# EAGLE design esp32 relay attempt 1 (EAGLE 9.6.2)
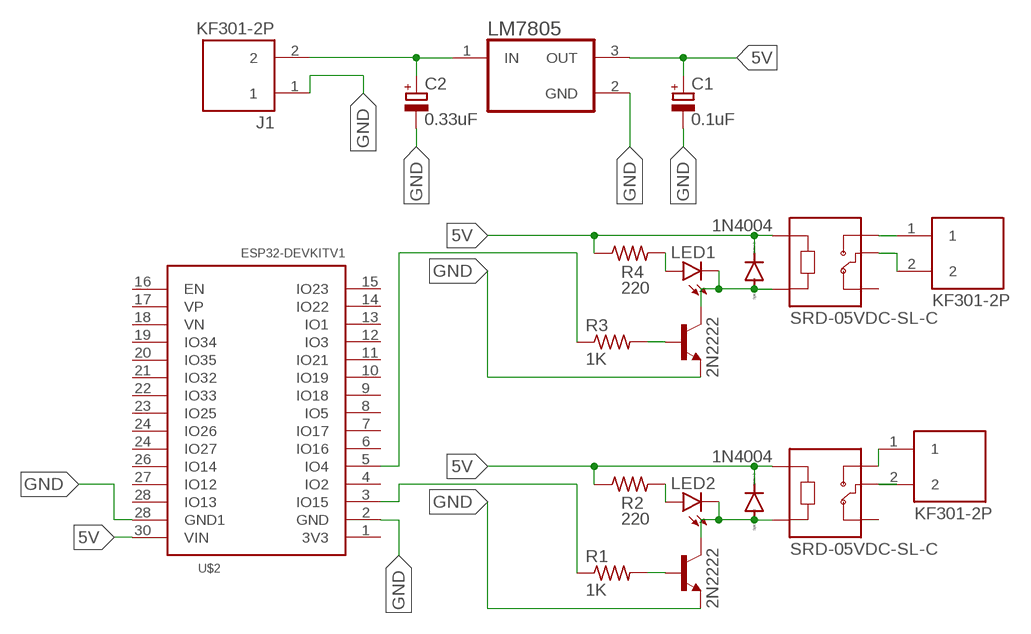
[diagram p0: schematic, sheet 1]

## Parts
C1  0.1uF  CPOL-EUE2.5-6  [E2,5-6]
C2  0.33uF  CPOL-EUE2.5-6  [E2,5-6]
D1  1N4004  [DO41-10]
D2  1N4004  [DO41-10]
J1  KF301-2P  [HANDSON_KF301-2P]
J2  KF301-2P  [HANDSON_KF301-2P]
J3  KF301-2P  [HANDSON_KF301-2P]
K1  SRD-05VDC-SL-C  [RELAY_SRD-05VDC-SL-C]
K2  SRD-05VDC-SL-C  [RELAY_SRD-05VDC-SL-C]
LED1  LED5MM  [LED5MM]
LED2  LED5MM  [LED5MM]
LM7805  LM7805CT/NOPB  [TO254P1054X470X2600-3]
R1  1K  R-US_0204/7  [0204/7]
R2  220  R-US_0204/7  [0204/7]
R3  1K  R-US_0204/7  [0204/7]
R4  220  R-US_0204/7  [0204/7]
T1  2N2222  [TO92-EBC-OVAL]
T2  2N2222  [TO92-EBC-OVAL]
U$2  ESP32DEVKITV1  [ESP32-DEVKITV1]

## Nets
5V: C1.+ D1.C D2.C K1.A1 K2.A1 LM7805.3(OUT) R2.1 R4.1 U$2.30(VIN)
GND: C1.- C2.- J1.1 LM7805.2(GND) T1.E T2.E U$2.2(GND) U$2.28(GND1)
N$1: J2.1 K1.NO
N$2: J2.2 K1.COM
N$3: C2.+ J1.2 LM7805.1(IN)
N$5: D1.A K1.A2 LED1.K(C) T1.C
N$7: R3.2 T1.B
N$8: R3.1 U$2.5(IO4)
N$9: LED1.A R4.2
N$10: J3.1 K2.NO
N$11: J3.2 K2.COM
N$13: D2.A K2.A2 LED2.K(C) T2.C
N$15: R1.2 T2.B
N$16: R1.1 U$2.3(IO15)
N$17: LED2.A R2.2
Unconnected: K1.NC K2.NC U$2.1(3V3) U$2.4(IO2) U$2.6(IO16) U$2.7(IO17) U$2.8(IO5) U$2.9(IO18) U$2.10(IO19) U$2.11(IO21) U$2.12(IO3) U$2.13(IO1) U$2.14(IO22) U$2.15(IO23) U$2.16(EN) U$2.17(VP) U$2.18(VN) U$2.19(IO34) U$2.20(IO35) U$2.21(IO32) U$2.22(IO33) U$2.23(IO25) U$2.24(IO26) U$2.24(IO27) U$2.26(IO14) U$2.27(IO12) U$2.28(IO13)

## Library data of the parts
C1 C2 = rcl:CPOL-EU: POLARIZED CAPACITOR, European symbol; SPICEPREFIX: C
D1 D2 = diode:1N4004: DIODE general purpose rectifier, 1 A
J1-J3 = KF301-2P:KF301-2P: 2 Pin Terminal Block 5mm Pitch Check availability <https://pricing.snapeda.com/parts/KF301-2P/Handson%20Technology/view-part?ref=eda>; AVAILABILITY: Not in stock; DESCRIPTION: 2 Pin Terminal Block 5mm Pitch; MF: Handson Technology; MP: KF301-2P; PACKAGE: None; PRICE: None
K1 K2 = SRD-05VDC-SL-C:SRD-05VDC-SL-C: 5V Trigger Relay Module For Arduino And Raspberry Pi 5V Trigger Relay Module For Arduino And Raspberry Pi Check availability <https://pricing.snapeda.com/parts/SRD-05VDC-SL-C/Songle%20Relay/view-part?ref=eda>; AVAILABILITY: Not in stock; DESCRIPTION: 5V Trigger Relay Module For Arduino And Raspberry Pi 5V Trigger Relay Module For Arduino And Raspberry Pi; MF: Songle Relay; MP: SRD-05VDC-SL-C; PACKAGE: NON STANDARD-5 Songle Relay; PRICE: None
LED1 LED2 = led:LED: LED OSRAM: - CHIPLED LG R971, LG N971, LY N971, LG Q971, LY Q971, LO R971, LY R971 LH N974, LH R974 LS Q976, LO Q976, LY Q976 LO Q996 - Hyper CHIPLED LW Q18S LB Q993, LB Q99A, LB R99A - SideLED LS A670, LO A670, LY A670, LG A670, LP A670 LB A673, LV A673, LT A673, LW A673 LH A674 LY A675 LS A676, LA A676, LO A676, LY A676, LW A676 LS A679, LY A679, LG A679 - Hyper Micro SIDELED® LS Y876, LA Y876, LO Y876, LY Y876 LT Y87S - SmartLED LW L88C, LW L88S LB L89C, LB L89S, LG L890 LS L89K, LO L89K, LY L89K LS L896, LA L896, LO L896, LY L896 - TOPLED LS T670, LO T670, LY T670, LG T670, LP T670 LSG T670, LSP T670, LSY T670, LOP T670, LYG T670 LG T671, LOG T671, LSG T671 LB T673, LV T673, LT T673, LW T673 LH T674 LS T676, LA T676, LO T676, LY T676, LB T676, LH T676, LSB T676, LW T676 LB T67C, LV T67C, LT T67C, LS T67K, LO T67K, LY T67K, LW E67C LS E67B, LA E67B, LO E67B, LY E67B, LB E67C, LV E67C, LT E67C LW T67C LS T679, LY T679, LG T679 LS T770, LO T770, LY T770, LG T770, LP T770 LB T773, LV T773, LT T773, LW T773 LH T774 LS E675, LA E675, LY E675, LS T675 LS T776, LA T776, LO T776, LY T776, LB T776 LHGB T686 LT T68C, LB T68C - Hyper Mini TOPLED® LB M676 - Mini TOPLED Santana® LG M470 LS M47K, LO M47K, LY M47K Source: http://www.osram.convergy.de LUXEON: - LUMILED® LXK2-PW12-R00, LXK2-PW12-S00, LXK2-PW14-U00, LXK2-PW14-V00 LXK2-PM12-R00, LXK2-PM12-S00, LXK2-PM14-U00 LXK2-PE12-Q00, LXK2-PE12-R00, LXK2-PE12-S00, LXK2-PE14-T00, LXK2-PE14-U00 LXK2-PB12-K00, LXK2-PB12-L00, LXK2-PB12-M00, LXK2-PB14-N00, LXK2-PB14-P00, LXK2-PB14-Q00 LXK2-PR12-L00, LXK2-PR12-M00, LXK2-PR14-Q00, LXK2-PR14-R00 LXK2-PD12-Q00, LXK2-PD12-R00, LXK2-PD12-S00 LXK2-PH12-R00, LXK2-PH12-S00 LXK2-PL12-P00, LXK2-PL12-Q00, LXK2-PL12-R00 Source: www.luxeon.com KINGBRIGHT: KA-3528ASYC Source: www.kingbright.com
LM7805 = LM7805CT_NOPB:LM7805CT/NOPB: Standard Regulator Pos 5V 1A 3-Pin(3+Tab) TO-220 Rail Check availability <https://pricing.snapeda.com/parts/LM7805CT/ON%20Semiconductor/view-part?ref=eda>; AVAILABILITY: In Stock; DESCRIPTION: Linear Voltage Regulator IC Positive Fixed 1 Output 1.5A TO-220-3; MF: ON Semiconductor; MP: LM7805CT; PACKAGE: TO-220-3 ON Semiconductor; PRICE: None; PURCHASE-URL: https://pricing.snapeda.com/search/part/LM7805CT/?ref=eda
R1-R4 = rcl:R-US_: RESISTOR, American symbol; SPICEPREFIX: R
T1 T2 = adafruit:2N2222: NPN TRANSISTOR Big oval pads
U$2 = ESP32-DEVKITV1:ESP32DEVKITV1

## Board
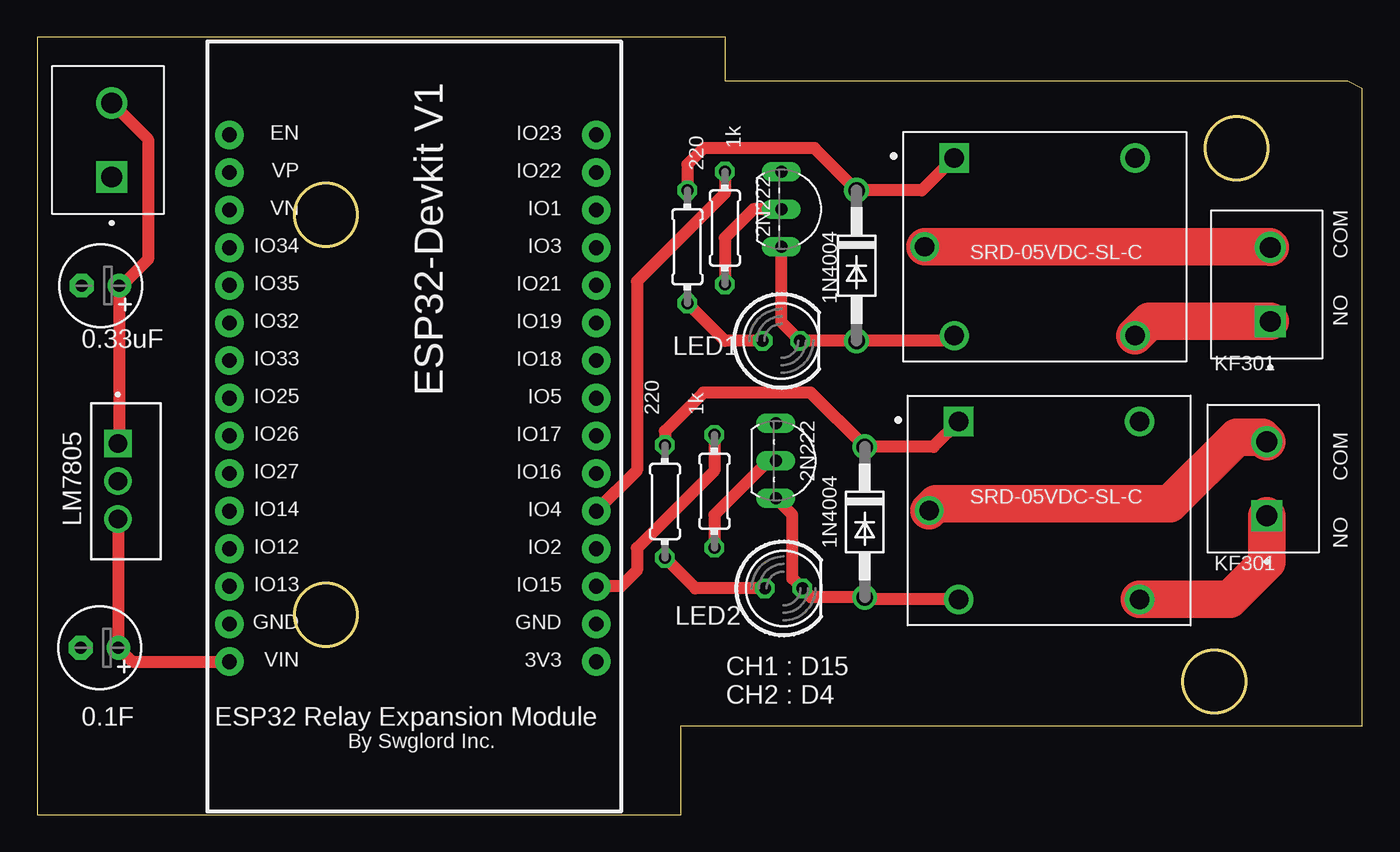
[diagram p1: board, top side]
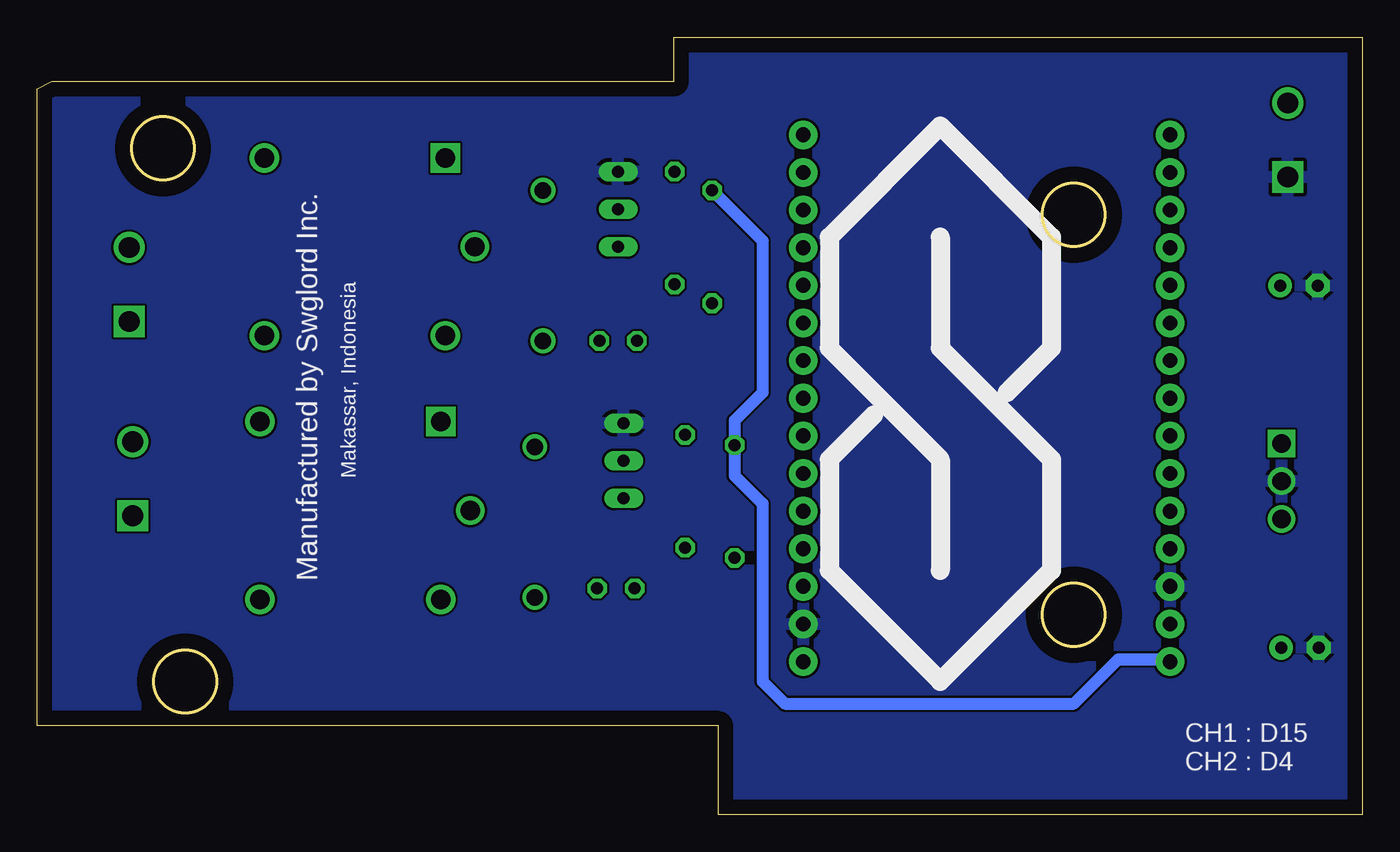
[diagram p2: board, bottom side, seen from below]

Size 89.5 x 52.5 mm. Coordinates in mm from the lower left corner, seen from the top.
Outline: 0,0 43.5,0 43.5,6 89.5,6 89.5,49 88.5,49.5 46.5,49.5 46.5,52.5 0,52.5 0,0
Outline: circle at 79.5,9 radius 2.12
Outline: circle at 81,45 radius 2.12
Outline: circle at 19.5,40.5 radius 2.12
Outline: circle at 19.5,13.5 radius 2.12
Copper layers (1*16): Top 0.035mm / dielectric 1.5mm / Bottom 0.035mm
Design rules "default": minimum track width 6mil, minimum drill 0.35mm, track to track 6mil, track to pad 6mil, pad to pad 6mil, via to via 6mil, smd to smd 6mil, copper to edge 40mil, drill to drill 6mil, minimum pad ring 10mil, minimum via ring 8mil, stop-mask expansion 4mil, vias tented up to drill 0mil, thermal gap 10mil

### Footprints (pad centres in the part's own frame; a part is rotated, then mirrored left to right if it is on the bottom)
E2,5-6 = drill 0.813 pad 1.6: + -1.27,0 | drill 0.813 pad 1.6 octagon: - 1.27,0
DO41-10 = drill 1.118: A 5.08,0; C -5.08,0
HANDSON_KF301-2P = drill 1.4 square: 1 -2.5,0 | drill 1.4: 2 2.5,0
RELAY_SRD-05VDC-SL-C = drill 1.32 square: A1 -6.1,6 | drill 1.32: A2 -6.1,-6; NC 6.1,6; NO 6.1,-6 | drill 1.29: COM -8.1,0
LED5MM = drill 0.813 octagon: A -1.27,0; K 1.27,0
TO254P1054X470X2600-3 = drill 1.24 square: 1 0,0 | drill 1.24: 2 2.54,0; 3 5.08,0
0204/7 = drill 0.813 octagon: 1 -3.81,0; 2 3.81,0
TO92-EBC-OVAL = drill 0.813 long: B 0,-1.27; C 2.54,-1.27; E -2.54,-1.27
ESP32-DEVKITV1 = drill 1 pad 1.93: 1 -22.87,-13.54; 2 -20.33,-13.54; 3 -17.79,-13.54; 4 -15.25,-13.54; 5 -12.71,-13.54; 6 -10.17,-13.54; 7 -7.63,-13.54; 8 -5.09,-13.54; 9 -2.55,-13.54; 10 -0.01,-13.54; 11 2.53,-13.54; 12 5.07,-13.54; 13 7.61,-13.54; 14 10.15,-13.54; 15 12.69,-13.54; 16 12.69,11.23; 17 10.15,11.23; 18 7.61,11.23; 19 5.07,11.23; 20 2.53,11.23; 21 -0.01,11.23; 22 -2.55,11.23; 23 -5.09,11.23; 24 -7.63,11.23; 25 -10.17,11.23; 26 -12.71,11.23; 27 -15.25,11.23; 28 -17.79,11.23; 29 -20.33,11.23; 30 -22.87,11.23

### Placement (x,y rotation side)
C1  4.22,11.28 180 top
C2  4.29,35.72 180 top
D1  55.34,37.07 270 top
D2  55.89,19.76 270 top
J1  5.04,45.55 90 top
J2  83.28,35.8 90 top
J3  83.04,22.69 90 top
K1  68.04,38.34 0 top
K2  68.34,20.54 0 top
LED1  50.26,31.99 0 top
LED2  50.41,15.28 0 top
LM7805  5.46,25.06 270 top
R1  45.74,21.84 270 top
R2  42.4,21.15 270 top
R3  46.45,39.61 270 top
R4  43.91,38.34 270 top
T1  51.53,40.88 270 top
T2  51.16,23.9 270 top
U$2  24.22,33.21 90 top

### Tracks (layer width: path | path; a pad name or v marks a point on that pad's centre or on a via)
5V
  Top 0.813: K1.A1 59.75,42.15 D1.C 52.5,44.99 52.5,45 45,45 43.91,43.91 R4.1 | K2.A1 60.54,24.84 D2.C 52.23,28.5 45,28.5 42.4,25.9 R2.1 | LM7805.3 5.49,19.95 C1.+ 6.43,10.34 U$2.30
  Bottom 0.813: R4.1 40.5,38.74 40.5,28.5 42.4,26.6 R2.1 42.4,22.9 40.5,21 40.5,9 39,7.5 19.5,7.5 16.5,10.5 13.15,10.5 U$2.30
GND
  pour Bottom: -4.5,52.5 -4.5,-3 94.5,-3 94.5,55.5 -4.5,55.5
N$1
  Top 2.54: K1.NO 75.1,33.3 J2.1
N$2
  Top 2.54: K1.COM 83.24,38.34 J2.2
N$3
  Top 0.813: J1.2 7.5,45.59 7.5,37.5 5.72,35.72 C2.+ 5.56,25.16 LM7805.1
N$5
  Top 0.813: K1.A2 61.59,31.99 D1.A LED1.K 50.26,33.26 T1.C
N$7
  Top 0.813: T1.B 48.38,40.88 46.45,38.95 R3.2
N$8
  Top 0.813: R3.1 46.45,41.95 40.5,36 40.5,23.24 U$2.5
N$9
  Top 0.813: LED1.A 46.45,31.99 R4.2
N$10
  Top 2.54: J3.1 83.04,17.04 80.54,14.54 K2.NO
N$11
  Top 2.54: K2.COM 60.7,21 76.5,21 81,25.5 82.73,25.5 J3.2
N$13
  Top 0.813: K2.A2 56.03,14.54 D2.A 52.28,14.68 LED2.K 51,15.96 51,20.25 T2.C
N$15
  Top 0.813: T2.B 49.4,23.9 45.74,20.24 R1.2
N$16
  Top 0.813: R1.1 45.74,23.24 40.5,18 40.5,16.5 39.42,15.42 U$2.3
N$17
  Top 0.813: LED2.A 44.46,15.28 R2.2

### Text on the board
tPlace: 1k | 220 | 2N222 | SRD-05VDC-SL-C | 1N4004 | NO COM | 0.33uF | KF301 | 220 | 1k | 2N222 | SRD-05VDC-SL-C | LM7805 | 1N4004 | NO COM | KF301 | CH1 : D15 / CH2 : D4 | 0.1F | ESP32 Relay Expansion Module | By Swglord Inc.
bPlace: Manufactured by Swglord Inc. | Makassar, Indonesia | CH1 : D15 / CH2 : D4